# EAGLE design controller_PS (EAGLE 9.6.2)
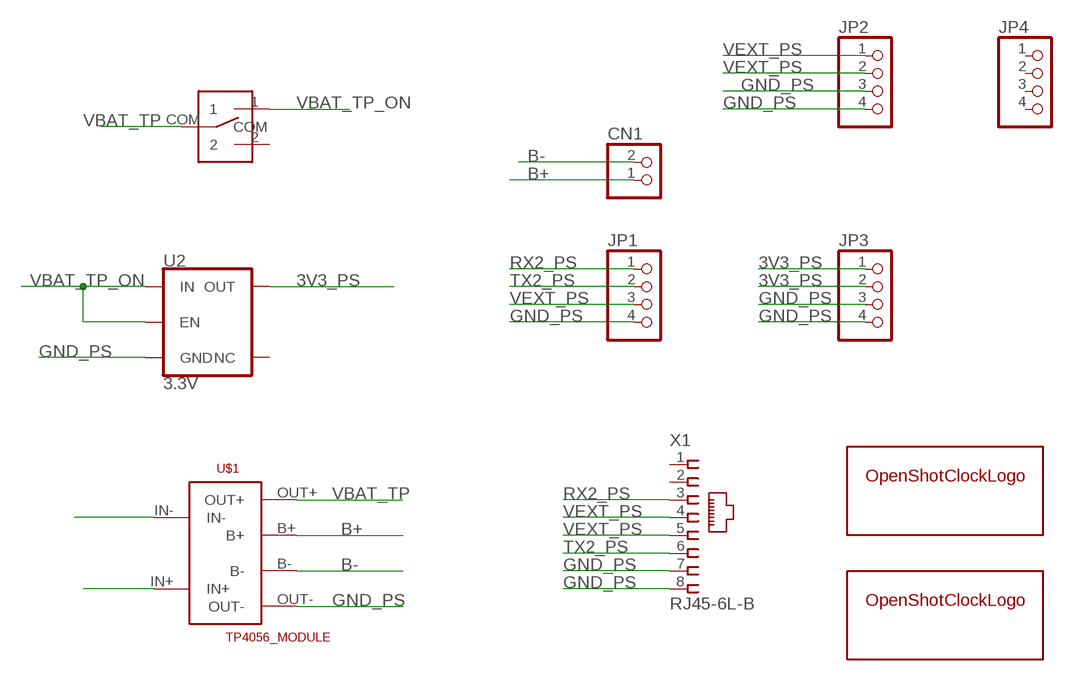
[diagram p0: schematic, sheet 1]

## Parts
CN1  JST_2PIN-THM-RA  [JST-PH-2-THM-RA]
JP1  PINHD-1X4  [1X04]
JP2  PINHD-1X4  [1X04]
JP3  PINHD-1X4  [1X04]
JP4  PINHD-1X4  [1X04]
U2  3.3V  V_REG_AP2112K-3.3V  [SOT23-5]
U$1  TP4056_MODULE  [TP4056_MODULE]
U$3  OPEN-SHOT-CLOCK-LOGOOSCL-SMALL  [OPEN-SHOT-CLOCK-LOGO-SMALL]
U$4  OPEN-SHOT-CLOCK-LOGOOSCL-SMALL  [OPEN-SHOT-CLOCK-LOGO-SMALL]
U$6  SK12D07VG4  [SK12D07VG4]
X1  RJ45-6L-B  [RJ45-NO-SHIELD]

## Nets
3V3_PS: JP3.1 JP3.2 U2.5(OUT)
B+: CN1.1 U$1.B+
B-: CN1.2 U$1.B-
GND_PS: JP1.4 JP2.3 JP2.4 JP3.3 JP3.4 U2.2(GND) U$1.OUT- X1.7 X1.8
N$4: U$1.IN-
N$8: U$1.IN+
RX2_PS: JP1.1 X1.3
TX2_PS: JP1.2 X1.6
VBAT_TP: U$1.OUT+ U$6.COM
VBAT_TP_ON: U2.1(IN) U2.3(EN) U$6.1
VEXT_PS: JP1.3 JP2.1 JP2.2 X1.4 X1.5
Unconnected: JP4.1 JP4.2 JP4.3 JP4.4 U2.4(NC) U$6.2 X1.1 X1.2

## Library data of the parts
CN1 = adafruit:JST_2PIN: JST 2-Pin Connectors of various flavors SMT-RA (S2B-PH-SM4) 4UConnector #17311 SMT (B2B-PH-SM4) THM-RA (S2B-PH) THM (B2B-PH)
JP1-JP4 = pinhead:PINHD-1X4: PIN HEADER
U2 = SparkFun-IC-Power:V_REG_AP2112: AP2112 - 600mA CMOS LDO Regulator w/ Enable The AP2112 is CMOS process low dropout linear regulator with enable function, the regulator delivers a guaranteed 600mA (min.) continuous load current. Features Output Voltage Accuracy: ±1.5% Output Current: 600mA (Min.) Foldback Short Current Protection: 50mA Enable Function to Turn ON/OFF VOUT Low Dropout Voltage (3.3V): 250mV (Typ.) @IOUT=600mA Excellent Load Regulation: 0.2%/A (Typ.) Excellent Line Regulation: 0.02%/V (Typ.) Low Quiescent Current: 55μA (Typ.) Low Standby Current: 0.01μA (Typ.) Low Output Noise: 50μVRMS PSRR: 100Hz -65dB, 1kHz -65dB OTSD Protection Stable with 1.0μF Flexible Cap: Ceramic, Tantalum and Aluminum Electrolytic Operation Temperature Range: -40°C to 85°C ESD: MM 400V, HBM 4000V; PROD_ID: VREG-12457
U$1 = TP4056_Module:TP4056_MODULE
U$3 U$4 = openShotClockLogo:OPEN-SHOT-CLOCK-LOGO
U$6 = SK12D07VG4:SK12D07VG4: SPDT switch LCSC very cheap Check availability <https://pricing.snapeda.com/parts/SK12D07VG4/C%26K/view-part?ref=eda>; AVAILABILITY: In Stock; DESCRIPTION: Switch Slide ON ON SPDT Side Slide 0.3A 30VDC PC Pins Bracket Mount/Through Hole Bulk; MF: C&K; MP: SK12D07VG4; PACKAGE: None; PRICE: None; PURCHASE-URL: https://pricing.snapeda.com/search/part/SK12D07VG4/?ref=eda
X1 = RJ45_from_con-tycoel:RJ45: CORCOM Modular RJ Jacks No Shield Source: www.tycoelectronics.com .. ENG_DS_1654001_1099_RJ_L_0507.pdf; MPN: RJ45-6L-B; OC_FARNELL: unknown; OC_NEWARK: 16R6090

## Board
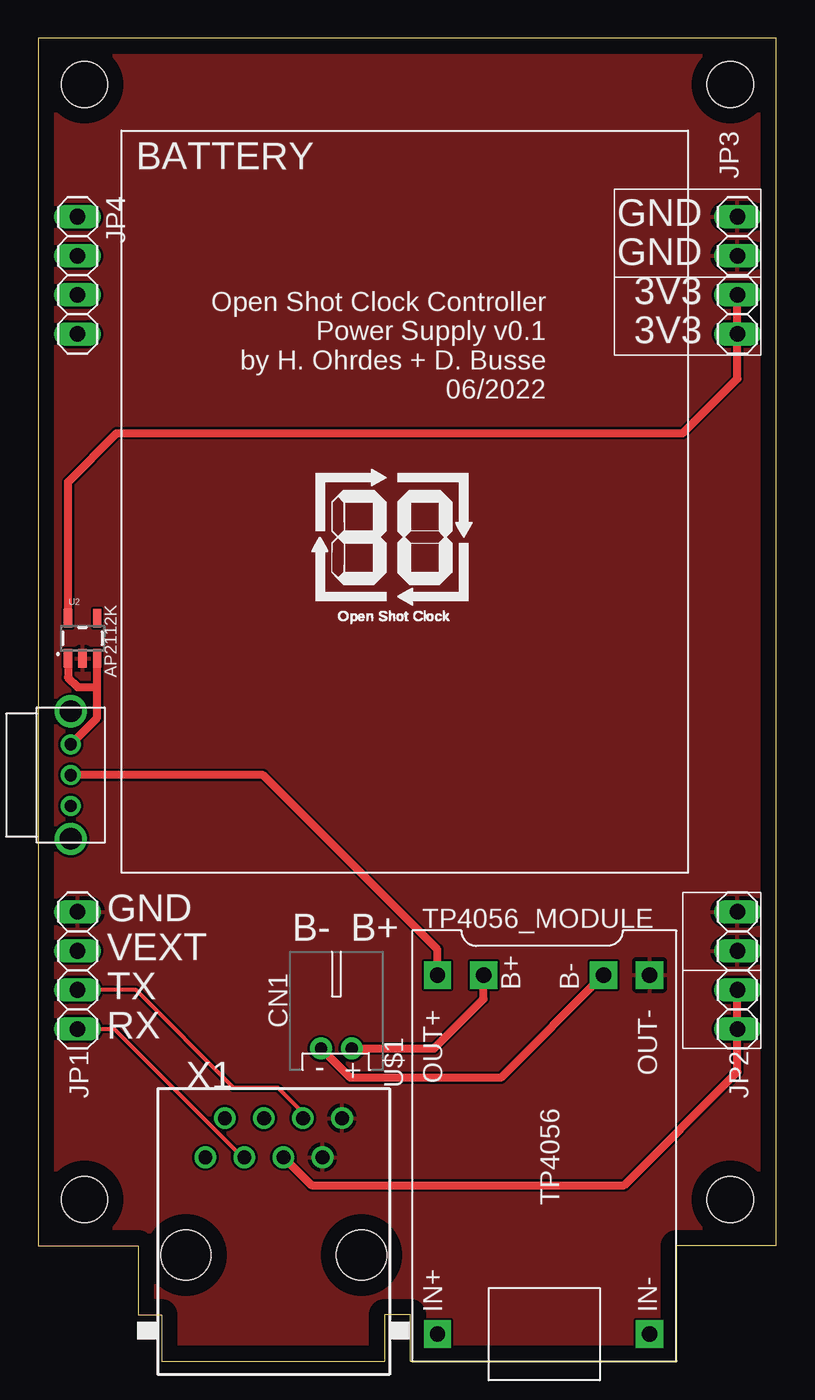
[diagram p1: board, top side]
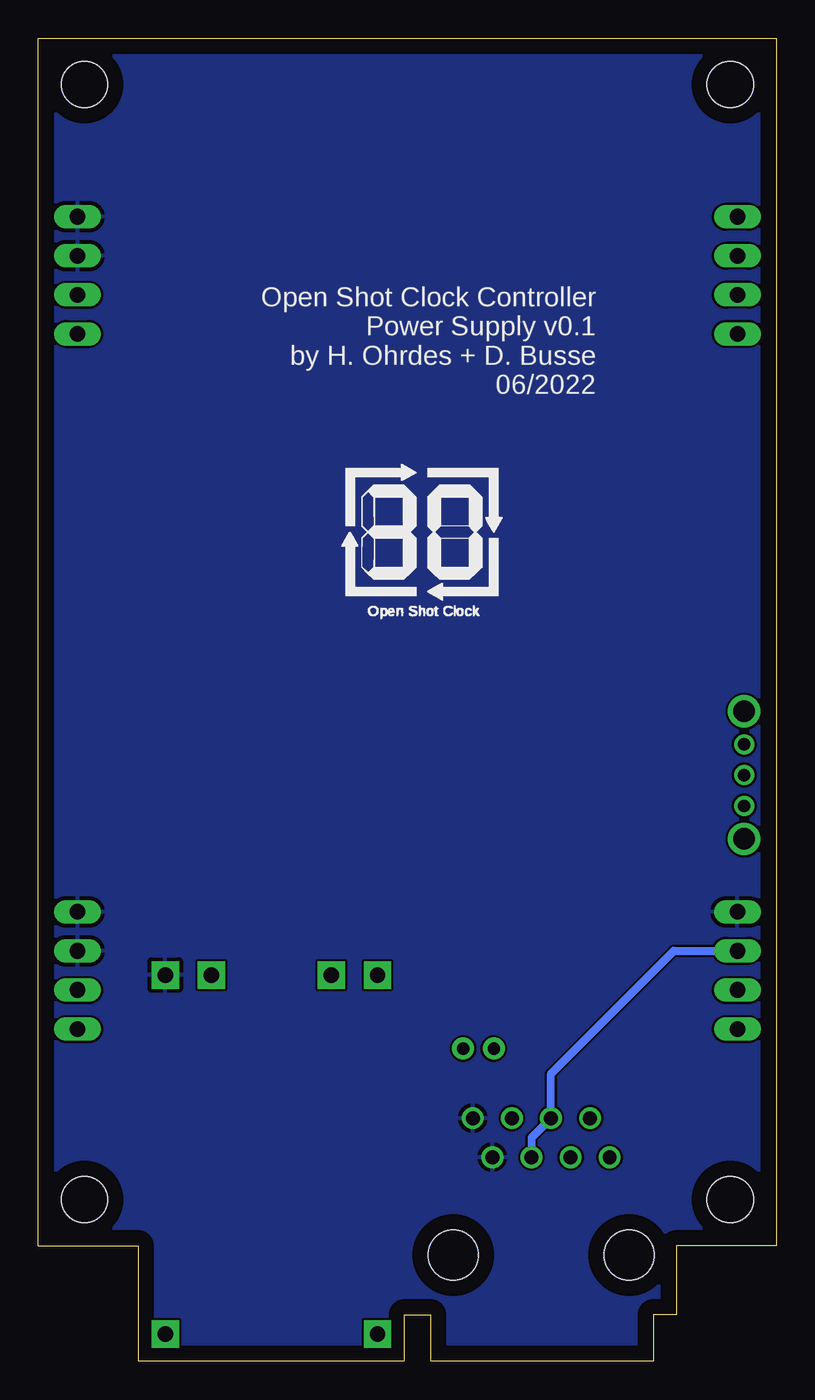
[diagram p2: board, bottom side, seen from below]

Size 48 x 86 mm. Coordinates in mm from the lower left corner, seen from the top.
Outline: 48,7.5 48,86 0,86 0,7.5 6.5,7.5 6.5,3 8,3 8,0 22.5,0 22.5,3 24.2,3 24.2,0 41.5,0 41.5,7.5 48,7.5
Copper layers (1*16): Top 0.035mm / dielectric 1.5mm / Bottom 0.035mm
Design rules "default": minimum track width 6mil, minimum drill 0.35mm, track to track 6mil, track to pad 6mil, pad to pad 6mil, via to via 6mil, smd to smd 6mil, copper to edge 40mil, drill to drill 6mil, minimum pad ring 10mil, minimum via ring 8mil, stop-mask expansion 4mil, vias tented up to drill 0mil, thermal gap 10mil
Holes 3 mm at 3,10.5 3,83 45,83 45,10.5

### Footprints (pad centres in the part's own frame; a part is rotated, then mirrored left to right if it is on the bottom)
JST-PH-2-THM-RA = drill 0.8 pad 1.422: 1 1,0; 2 -1,0
1X04 = drill 1.016 long: 1 -3.81,0; 2 -1.27,0; 3 1.27,0; 4 3.81,0
SOT23-5 = smd 0.55 x 1.2: 1 -0.95,-1.3; 2 0,-1.3; 3 0.95,-1.3; 4 0.95,1.3; 5 -0.95,1.3
TP4056_MODULE = drill 1 pad 1.778 square: B+ 25.1,12.55; B- 25.1,4.75; IN+ 1.75,15.55; IN- 1.75,1.75; OUT+ 25.1,15.55; OUT- 25.1,1.75
SK12D07VG4 = drill 0.8: 1 -2,0; 2 2,0; COM 0,0 | drill 1.4: M1 -4.15,0; M2 4.15,0
RJ45-NO-SHIELD = drill 0.9 pad 1.4: 1 -4.445,6.35; 2 -3.175,8.89; 3 -1.905,6.35; 4 -0.635,8.89; 5 0.635,6.35; 6 1.905,8.89; 7 3.175,6.35; 8 4.445,8.89 | hole 3.251: -5.715,0; 5.715,0

### Placement (x,y rotation side)
CN1  19.38,20.32 0 top
JP1  2.54,25.4 90 top
JP2  45.46,25.4 90 top
JP3  45.46,70.6 90 top
JP4  2.54,70.6 270 top
U2  2.87,46.99 0 top
U$1  41.5,0 90 top
U$3  28.27,48.26 0 bottom
U$4  17.78,47.93 0 top
U$6  2.1,38.1 270 top
X1  15.3,6.9 0 top

### Tracks (layer width: path | path; a pad name or v marks a point on that pad's centre or on a via)
3V3_PS
  Top 0.508: JP3.2 JP3.1 45.46,63.88 41.91,60.33 5.08,60.33 1.92,57.16 U2.5
B+
  Top 0.508: U$1.B+ 28.95,23.54 25.73,20.32 CN1.1
B-
  Top 0.508: U$1.B- 30.07,18.41 20.29,18.41 CN1.2
GND_PS
  pour Top: 0,86.36 0,-1.27 48.58,-1.27 48.58,86.36
  pour Bottom: -0.64,-0.64 49.84,-0.64 49.84,87 -0.64,87
RX2_PS
  Top 0.254: X1.3 13.27,13.25 4.93,21.59 JP1.1
TX2_PS
  Top 0.254: X1.6 17.2,16.14 15.57,17.78 12.7,17.78 6.35,24.13 JP1.2
VBAT_TP
  Top 0.508: U$1.OUT+ 25.95,26.75 14.61,38.1 U$6.COM
VBAT_TP_ON
  Top 0.508: U$6.1 3.82,41.82 3.82,43.81 | 3.82,43.81 U2.3 | U2.1 1.92,44.47 1.91,44.45 2.54,43.81 3.82,43.81
VEXT_PS
  Top 0.508: X1.5 17.75,11.43 38.1,11.43 45.46,18.79 JP2.1 JP2.2
  Bottom 0.508: X1.5 15.94,14.52 X1.4 14.66,18.68 6.68,26.67 JP1.3

### Text on the board
tNames: BATTERY | GND | GND | Open Shot Clock Controller / Power Supply v0.1 / by H. Ohrdes + D. Busse / 06/2022 | 3V3 | 3V3 | AP2112K | GND | B- | B+ | VEXT | TX | RX
bNames: Open Shot Clock Controller / Power Supply v0.1 / by H. Ohrdes + D. Busse / 06/2022
tValues: GND | VEXT